# Altium project NanoEEG_v2_MCU.PrjPCB
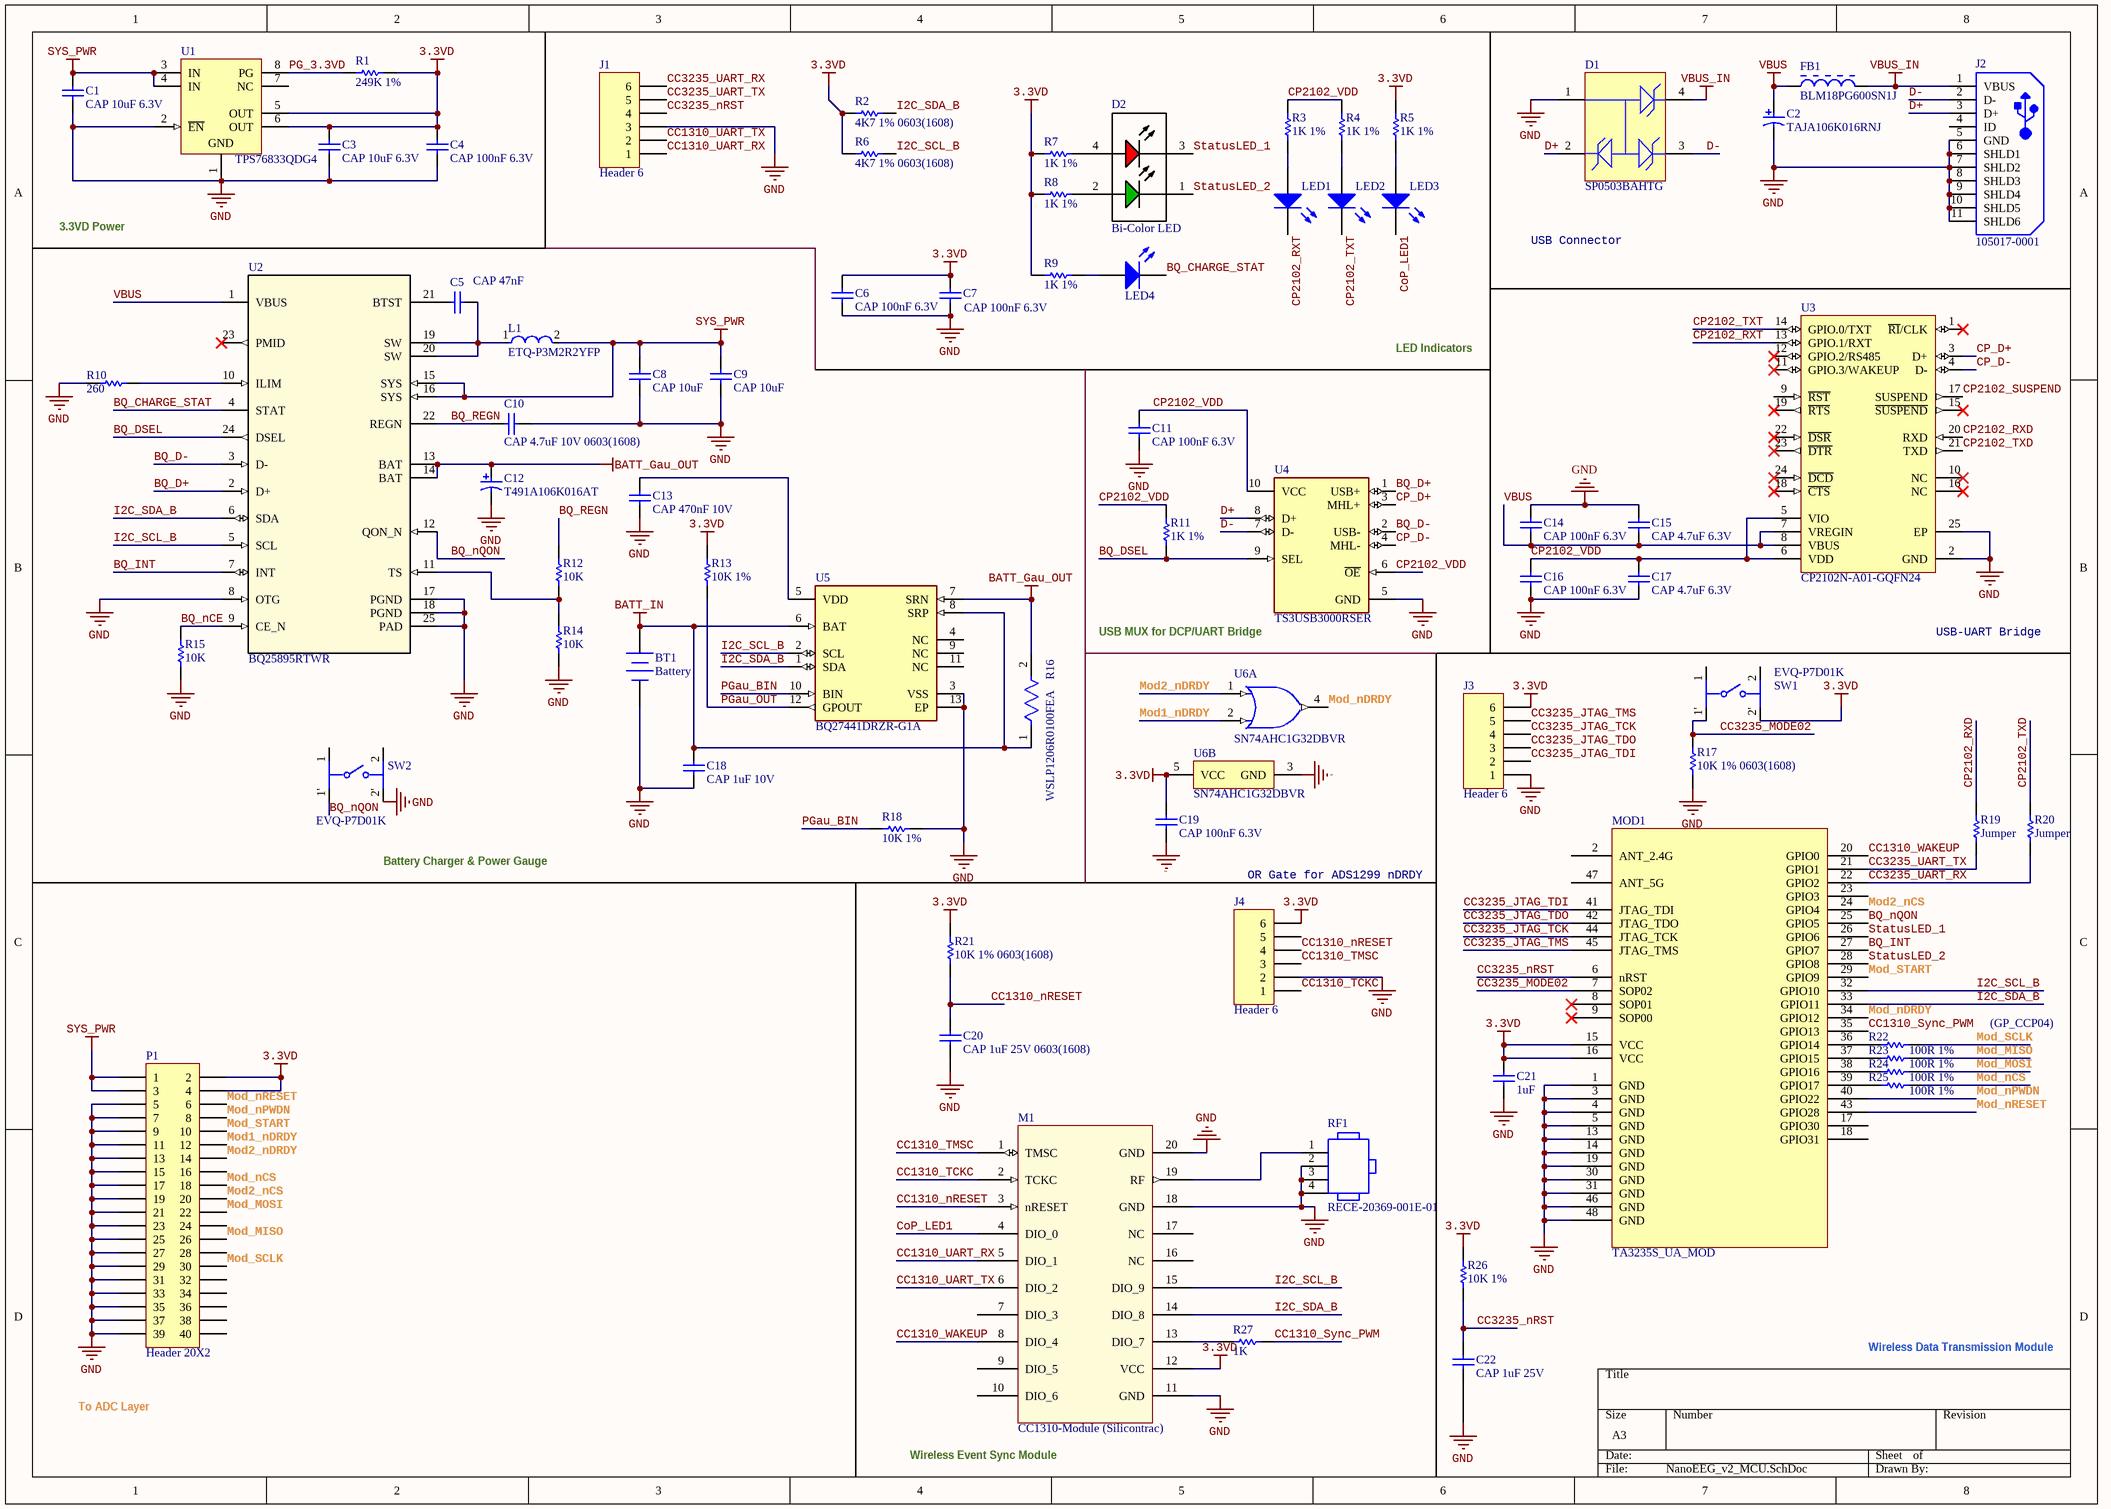
[diagram p0: NanoEEG_v2_MCU.SchDoc]
1 sheet, 75 parts. Net scope: global (net labels, ports and power ports of the same name join across sheets).
Board file: NanoEEG_v2_MCU.PcbDoc

## Sheet NanoEEG_v2_MCU.SchDoc
size A3

### Parts
(Parts that share a designator on the sheet are numbered #1, #2 ... from top to bottom, then left to right.)
BT1  Battery  [PH2.0-WS-2P]
C1  CAP 10uF 6.3V  [CAPC0603(1608)100_N]
C2  TAJA106K016RNJ  [CAPMP3217X18-T_V]
C3  CAP 10uF 6.3V  [CAPC0603(1608)100_N]
C4  CAP 100nF 6.3V  [CAPC0603(1608)100_N]
C5  CAP 47nF  [CAPC0603(1608)100_N]
C6  CAP 100nF 6.3V  [CAPC0603(1608)100_N]
C7  CAP 100nF 6.3V  [CAPC0603(1608)100_N]
C8  CAP 10uF  [CAPC0603(1608)100_N]
C9  CAP 10uF  [CAPC0603(1608)100_N]
C10  CAP 4.7uF 10V 0603(1608)  [CAPC0603(1608)55_N]
C11  CAP 100nF 6.3V  [CAPC0603(1608)100_N]
C12  T491A106K016AT  [KEMT-A-3216-18-2_N]
C13  CAP 470nF 10V  [CAPC0603(1608)100_N]
C14  CAP 100nF 6.3V  [CAPC0603(1608)100_N]
C15  CAP 4.7uF 6.3V  [CAPC0603(1608)100_N]
C16  CAP 100nF 6.3V  [CAPC0603(1608)100_N]
C17  CAP 4.7uF 6.3V  [CAPC0603(1608)100_N]
C18  CAP 1uF 10V  [CAPC0603(1608)100_N]
C19  CAP 100nF 6.3V  [CAPC0603(1608)100_N]
C20  CAP 1uF 25V 0603(1608)  [CAPC0603(1608)100_N]
C21  1uF  [CAPC0603(1608)100_N]
C22  CAP 1uF 25V  [CAPC0603(1608)100_N]
D1  SP0503BAHTG  [LFUS-SOT143-4_V]
D2  Bi-Color LED  [LED_Bi_Color_1204]
FB1  BLM18PG600SN1J  [MURA-BLM18PG_KG-CHIP-2_V2]
J1  Header 6  [GH-1.25-WS-6P]
J2  105017-0001  [USB-MICRO-B_V]
J3  Header 6  [GH-1.25-WS-6P]
J4  Header 6  [GH-1.25-WS-6P]
L1  ETQ-P3M2R2YFP  [FP-PCC-M0530M-MFG]
LED1  150060BS75000  [0603_A]  (value not drawn)
LED2  150060BS75000  [0603_A]  (value not drawn)
LED3  150060BS75000  [0603_A]  (value not drawn)
LED4  150060BS75000  [0603_A]  (value not drawn)
M1  CC1310-Module (Silicontrac)  [CC1310ZTR4-GC]
MOD1  TA3235S_UA_MOD  [TA_3235S_UA_MOD]
P1  Header 20X2  [FCI-B2B-0.8mm-40p-MALE]
R1  249K 1%  [RESC0603(1608)_N]
R2  4K7 1% 0603(1608)  [RESC0603(1608)_N]
R3  1K 1%  [RESC0603(1608)_N]
R4  1K 1%  [RESC0603(1608)_N]
R5  1K 1%  [RESC0603(1608)_N]
R6  4K7 1% 0603(1608)  [RESC0603(1608)_N]
R7  1K 1%  [RESC0603(1608)_N]
R8  1K 1%  [RESC0603(1608)_N]
R9  1K 1%  [RESC0603(1608)_N]
R10  260  [RESC0603(1608)_N]
R11  1K 1%  [RESC0603(1608)_N]
R12  10K  [RESC0603(1608)_N]
R13  10K 1%  [RESC0603(1608)_N]
R14  10K  [RESC0603(1608)_N]
R15  10K  [RESC0603(1608)_N]
R16  WSLP1206R0100FEA  [FP-WSLP1206-FP_1_65x1_93x-IPC_B]
R17  10K 1% 0603(1608)  [RESC0603(1608)_N]
R18  10K 1%  [RESC0603(1608)_N]
R19  Jumper  [RESC0603(1608)_N]
R20  Jumper  [RESC0603(1608)_N]
R21  10K 1% 0603(1608)  [RESC0603(1608)_N]
R22  100R 1%  [RESC0603(1608)_N]
R23  100R 1%  [RESC0603(1608)_N]
R24  100R 1%  [RESC0603(1608)_N]
R25  100R 1%  [RESC0603(1608)_N]
R26  10K 1%  [RESC0603(1608)_N]
R27  1K  [RESC0603(1608)_N]
RF1  RECE-20369-001E-01  [IPEX_MHF_I]
SW1  EVQ-P7D01K  [FP-EVQ-P7D01K-MFG]
SW2  EVQ-P7D01K  [FP-EVQ-P7D01K-MFG]
U1  TPS76833QDG4  [TI-D8_M]
U2  BQ25895RTWR  [RTW0024H]
U3  CP2102N-A01-GQFN24  [SLAB-QFN-24-2550x2550TP_A_V]
U4  TS3USB3000RSER  [FP-TS3USB3000RSER-MFG]
U5  BQ27441DRZR-G1A  [FP-DRZ0012A-MFG_M]
U6#1  SN74AHC1G32DBVR  [DBV0005A_N]  (part A of 2)
U6#2  SN74AHC1G32DBVR  [DBV0005A_N]  (part B of 2)

### Nets
3.3VD: C3.2 C4.2 C6.2 C7.2 C19.2 C21.2 J3.6 J4.6 M1.12(VCC) MOD1.15(VCC) MOD1.16(VCC) P1.2 P1.4 R1.2 R2.1 R5.2 R6.1 R7.1 R8.1 R9.2 R13.1 R21.2 R26.2 SW1.2' U1.5(OUT) U1.6(OUT) U6#2.5(VCC)
BATT_Gau_OUT: C12.1 R16.2 U2.13(BAT) U2.14(BAT) U5.7(SRN)
BATT_IN: BT1.1(+) C18.2 R16.1 U5.6(BAT) U5.8(SRP)
GND: BT1.2(-) C1.1 C2.2 C3.1 C4.1 C6.1 C7.1 C8.1 C9.1 C10.2 C11.1 C12.2 C13.1 C14.2 C15.2 C16.1 C17.1 C18.1 C19.1 C20.1 C21.1 C22.1 D1.1 J1.3 J2.5(GND) J2.6(SHLD1) J2.7(SHLD2) J2.8(SHLD3) J2.9(SHLD4) J2.10(SHLD5) J2.11(SHLD6) J3.1 J4.2 M1.11(GND) M1.18(GND) M1.20(GND) MOD1.1(GND) MOD1.3(GND) MOD1.4(GND) MOD1.5(GND) MOD1.13(GND) MOD1.14(GND) MOD1.19(GND) MOD1.30(GND) MOD1.31(GND) MOD1.46(GND) MOD1.48(GND) P1.5 P1.7 P1.9 P1.11 P1.13 P1.15 P1.17 P1.19 P1.21 P1.23 P1.25 P1.27 P1.29 P1.31 P1.33 P1.35 P1.37 P1.39 R10.1 R14.2 R15.2 R17.1 R18.2 RF1.2 RF1.3 RF1.4 SW2.2' U1.1(GND) U1.2(~{EN}) U2.8(OTG) U2.17(PGND) U2.18(PGND) U2.25(PAD) U3.2(GND) U3.25(EP) U4.5(GND) U5.3(VSS) U5.13(EP) U6#2.3(GND)
SYS_PWR: C1.2 C8.2 C9.2 L1.2 P1.1 P1.3 U1.3(IN) U1.4(IN) U2.15(SYS) U2.16(SYS)
VBUS: C2.1 C14.1 C15.1 FB1.1 U2.1(VBUS) U3.7(VREGIN) U3.8(VBUS)
VBUS_IN: D1.4 FB1.2 J2.1(VBUS)
BQ_CHARGE_STAT: LED4.1(K) U2.4(STAT)
BQ_D+: U2.2(D+) U4.1(USB+)
BQ_D-: U2.3(D-) U4.2(USB-)
BQ_DSEL: R11.2 U2.24(DSEL) U4.9(SEL)
BQ_INT: MOD1.27(GPIO7) U2.7(INT)
BQ_nCE: R15.1 U2.9(CE_N)
BQ_nQON: MOD1.25(GPIO5) SW2.1' U2.12(QON_N)
BQ_REGN: C10.1 R12.1 U2.22(REGN)
CC1310_nRESET: C20.2 J4.4 M1.3(nRESET) R21.1
CC1310_Sync_PWM: MOD1.35(GPIO13) R27.2
CC1310_TCKC: J4.1 M1.2(TCKC)
CC1310_TMSC: J4.3 M1.1(TMSC)
CC1310_UART_RX: J1.1 M1.5(DIO_1)
CC1310_UART_TX: J1.2 M1.6(DIO_2)
CC1310_WAKEUP: M1.8(DIO_4) MOD1.20(GPIO0)
CC3235_JTAG_TCK: J3.4 MOD1.44(JTAG_TCK)
CC3235_JTAG_TDI: J3.2 MOD1.41(JTAG_TDI)
CC3235_JTAG_TDO: J3.3 MOD1.42(JTAG_TDO)
CC3235_JTAG_TMS: J3.5 MOD1.45(JTAG_TMS)
CC3235_MODE02: MOD1.7(SOP02) R17.2 SW1.1'
CC3235_nRST: C22.2 J1.4 MOD1.6(nRST) R26.1
CC3235_UART_RX: J1.6 MOD1.22(GPIO2) R20.1
CC3235_UART_TX: J1.5 MOD1.21(GPIO1) R19.1
CoP_LED1: LED3.1(K) M1.4(DIO_0)
CP2102_RXD: R19.2 U3.20(RXD)
CP2102_RXT: LED1.1(K) U3.13(GPIO.1/RXT)
CP2102_SUSPEND: U3.17(SUSPEND)
CP2102_TXD: R20.2 U3.21(TXD)
CP2102_TXT: LED2.1(K) U3.14(GPIO.0/TXT)
CP2102_VDD: C11.2 C16.2 C17.2 R3.2 R4.2 R11.1 U3.5(VIO) U3.6(VDD) U4.6(~{OE}) U4.10(VCC)
CP_D+: U3.3(D+) U4.3(MHL+)
CP_D-: U3.4(D-) U4.4(MHL-)
D+: D1.2 J2.3(D+) U4.8(D+)
D-: D1.3 J2.2(D-) U4.7(D-)
I2C_SCL_B: M1.15(DIO_9) MOD1.32(GPIO10) R6.2 U2.5(SCL) U5.2(SCL)
I2C_SDA_B: M1.14(DIO_8) MOD1.33(GPIO11) R2.2 U2.6(SDA) U5.1(SDA)
Mod1_nDRDY: P1.12 U6#1.2(B)
Mod2_nCS: MOD1.24(GPIO4) P1.20
Mod2_nDRDY: P1.14 U6#1.1(A)
Mod_MISO: P1.26 R23.2
Mod_MOSI: P1.22 R24.2
Mod_nCS: P1.18 R25.2
Mod_nDRDY: MOD1.34(GPIO12) U6#1.4(Y)
Mod_nPWDN: MOD1.40(GPIO22) P1.8
Mod_nRESET: MOD1.43(GPIO28) P1.6
Mod_SCLK: P1.30 R22.2
Mod_START: MOD1.29(GPIO9) P1.10
PG_3.3VD: R1.1 U1.8(PG)
PGau_BIN: R18.1 U5.10(BIN)
PGau_OUT: R13.2 U5.12(GPOUT)
StatusLED_1: D2.3(Red-C) MOD1.26(GPIO6)
StatusLED_2: D2.1(Green-C) MOD1.28(GPIO8)
NetC5_1: C5.1 U2.21(BTST)
NetC5_2: C5.2 L1.1 U2.19(SW) U2.20(SW)
NetC13_2: C13.2 U5.5(VDD)
NetD2_2: D2.2(Green-A) R8.2
NetD2_4: D2.4(Red-A) R7.2
NetLED1_2: LED1.2(A) R3.1
NetLED2_2: LED2.2(A) R4.1
NetLED3_2: LED3.2(A) R5.1
NetLED4_2: LED4.2(A) R9.1
NetM1_13: M1.13(DIO_7) R27.1
NetM1_19: M1.19(RF) RF1.1
NetMOD1_36: MOD1.36(GPIO14) R22.1
NetMOD1_37: MOD1.37(GPIO15) R23.1
NetMOD1_38: MOD1.38(GPIO16) R24.1
NetMOD1_39: MOD1.39(GPIO17) R25.1
NetR10_2: R10.2 U2.10(ILIM)
NetR12_2: R12.2 R14.1 U2.11(TS)

Not connected (* = marked no-connect by the designer): J2 4(ID); J4 5; M1 7(DIO_3) 9(DIO_5) 10(DIO_6) 16(NC) 17(NC); MOD1 2(ANT_2.4G) 8(SOP01)* 9(SOP00)* 17(GPIO30) 18(GPIO31) 23(GPIO3) 47(ANT_5G); P1 16 24 28 32 34 36 38 40; SW1 1 2; SW2 1 2; U1 7(NC); U2 23(PMID)*; U3 1(~{RI}/CLK)* 9(~{RST}) 10(NC)* 11(GPIO.3/WAKEUP)* 12(GPIO.2/RS485)* 15(~{SUSPEND})* 16(NC)* 18(~{CTS})* 19(~{RTS})* 22(~{DSR})* 23(~{DTR})* 24(~{DCD})*; U5 4(NC) 9(NC) 11(NC)

### Notes on the sheet
- 3.3VD Power
- USB Connector
- LED Indicators
- (near U4) USB MUX for DCP/UART Bridge
- USB-UART Bridge
- Battery Charger & Power Gauge
- (near J4) OR Gate for ADS1299 nDRDY
- (GP_CCP04)
- Wireless Data Transmission Module
- To ADC Layer
- Wireless Event Sync Module

### Library data of the parts
BT1 = Battery: Multicell Battery; Published: 24-Mar-1999; LatestRevisionDate: 17-Jul-2002; LatestRevisionNote: Re-released for DXP Platform.; PackageReference: BAT-2; Publisher: Altium Limited; PackageDescription: Battery; 2 Leads
C1 C3 = CMP-1035-02796-1: CAP 10uF 6.3V ±10% 0603 (1608 Metric) Thickness 1mm SMD; Case-EIA: 0603; Tolerance: Â±10%; Case-Metric: 1608; Value: 10uF; Technology: SMT; Rated Voltage: 6.3 V; Max Thickness: 1 mm
C2 = CMP-1661-00004-1: Standard Tantalum, 10 uF, +/- 10%, 16 V, -55 to 125 degC, 2-Pin SMD (1206), RoHS, Tape and Reel; Frequency: 300 MHz; Vce Max: 500 mV; hFE Min: 60; Elements: 2; Case\Package: SOT-26; Max Power Dissipation: 300 mW; Min Operating Temperature: -55 degC; Width: 1.7 mm; ComponentLink2URL: http://datasheets.avx.com/TAJ.pdf; PackageDescription: 2-Pin Surface Mount Device, Body 3.2 x 1.65 mm; RoHSCompliant: true; ComponentLink2Description: Datasheet; Package Quantity: 3000; Max Operating Temperature: 150 degC; Length: 3.1 mm; Mount: Surface Mount; Packaging: Tape and Reel; ComponentLink1URL: http://www.avx.com/; ComponentLink1Description: Manufacturer URL; DatasheetVersion: Feb-16; ComponentLink3URL: http://www.avx.com/download/software/literature/AVX-Footprint-Library.pdf; ComponentLink3Description: Package Specification; Height: 1.3 mm; PackageReference: CAPMP3217X18-T; REACH SVHC: No SVHC; Pins: 6; Radiation Hardening: No
C4 C6 C7 C19 = CMP-1035-02576-1: CAP 100nF 6.3V ±10% 0603 (1608 Metric) Thickness 1mm SMD; Tolerance: Â±10%; Case-Metric: 1608; Case-EIA: 0603; Max Thickness: 1 mm; Value: 100nF; Rated Voltage: 6.3 V; Technology: SMT
C5 = CMP-1035-02503-1: CAP 47nF 16V ±10% 0603 (1608 Metric) Thickness 1mm SMD; Tolerance: Â±10%; Case-EIA: 0603; Case-Metric: 1608; Technology: SMT; Rated Voltage: 16 V; Max Thickness: 1 mm; Value: 47nF
C8 C9 = CMP-1035-02799-1: CAP 10uF 10V ±10% 0603 (1608 Metric) Thickness 1mm SMD; Tolerance: Â±10%; Case-Metric: 1608; Case-EIA: 0603; Max Thickness: 1 mm; Technology: SMT; Rated Voltage: 10 V; Value: 10uF
C10 = CMP-1035-02786-1: CAP 4.7uF 10V ±20% 0603 (1608 Metric) Thickness 0.55mm SMD; Tolerance: Â±20%; Case-EIA: 0603; Case-Metric: 1608; Technology: SMT; Max Thickness: 0.55 mm; Rated Voltage: 10 V; Value: 4.7uF
C11 C14 C16 = CMP-1035-02575-1: CAP 100nF 6.3V ±5% 0603 (1608 Metric) Thickness 1mm SMD; Tolerance: Â±5%; Case-Metric: 1608; Case-EIA: 0603; Technology: SMT; Rated Voltage: 6.3 V; Max Thickness: 1 mm; Value: 100nF
C12 = CMP-2000-05173-1: Capacitor, Tantalum, 10 uF, +/- 10%, 16 V, -55 to 125 degC, 2-Pin SMD (1206), RoHS, Tape and Reel; Manufacturer: Kemet; Insulation: NotRequired; Voltage: 16VDC; Capacitance: 10uF; Product Height (mm): 1.6mm; Polarity: Polar; Lead Spacing (nom): NotRequiredmm; Product Length (mm): 3.2mm; Case Style: Molded; DCL: 1.6uA; ESR: 7ohm; DF: 8%; Mounting Style: SurfaceMount; Manufacturer URL: http://www.kemet.com/; Datasheet Version: Apr-14; Package Description: 2-Pin Surface Mount Device, Body 3.2 x 1.6 mm; Operating Temp Range: -55Cto125C; Package Reference: 1206; Wire Form: NotRequired; Datasheet URL: http://www.farnell.com/datasheets/1824869.pdf; Tolerance (+ or -): 10%; Failure Rate: NotRequired; Length W/Weld: NotRequiredmm; Package / Case: 3216-18; Seated Plane Height: NotRequiredmm; Product Diameter (mm): NotRequiredmm; Construction: SMTChip; Seal: NotRequired; Case Code: A; Product Depth (mm): 1.6mm; Packaging: TapeandReel
C13 = CMP-1035-02697-1: CAP 470nF 10V ±20% 0603 (1608 Metric) Thickness 1mm SMD; Case-EIA: 0603; Case-Metric: 1608; Tolerance: Â±20%; Max Thickness: 1 mm; Rated Voltage: 10 V; Technology: SMT; Value: 470nF
C15 C17 = CMP-1035-02782-1: CAP 4.7uF 6.3V ±20% 0603 (1608 Metric) Thickness 1mm SMD; Case-EIA: 0603; Tolerance: Â±20%; Case-Metric: 1608; Technology: SMT; Rated Voltage: 6.3 V; Max Thickness: 1 mm; Value: 4.7uF
C18 = CMP-1035-02733-1: CAP 1uF 10V ±10% 0603 (1608 Metric) Thickness 1mm SMD; Tolerance: Â±10%; Case-EIA: 0603; Case-Metric: 1608; Rated Voltage: 10 V; Max Thickness: 1 mm; Value: 1uF; Technology: SMT
C20 C22 = CMP-1035-02741-1: CAP 1uF 25V ±20% 0603 (1608 Metric) Thickness 1mm SMD; Tolerance: Â±20%; Case-EIA: 0603; Case-Metric: 1608; Max Thickness: 1 mm; Technology: SMT; Rated Voltage: 25 V; Value: 1uF
C21 = CMP-1035-02588-1: CAP 100nF 25V ±10% 0603 (1608 Metric) Thickness 1mm SMD; Case-Metric: 1608; Case-EIA: 0603; Tolerance: Â±10%; Max Thickness: 1 mm; Technology: SMT; Rated Voltage: 25 V; Value: 100nF
D1 = CMP-2000-05191-1: TVS Diode Array, 30 pF, 30 KV, -40 to 85 degC, 4-Pin SOT143, RoHS, Tape and Reel; Manufacturer: Littelfuse; Direction Type: Uni-Directional; Product Height (mm): 1.05mm; Leakage Current (Max): 0.1uA; Clamping Voltage (Max): 8V; Reverse Stand-off Voltage: 5.5(Min)V; Configuration: Triple; Working Voltage: 5.5V; Product Length (mm): 3.04mm; Working Voltage (Max): 5.5V(Min); Capacitance Value: 30pF; Rad Hardened: No; Number of Elements: 3; Product Depth (mm): 1.4mm; Operating Temperature Max Deg. C: 85C; Suppressor Type: TVS; Operating Temperature Min Deg. C: -40C; Operating Temp Range: -40Cto85C; Mounting: SurfaceMount; Package / Case: SOT-143; Datasheet Version: Dec-13; Package Type: SOT-143; Packaging: TapeandReel; Pin Count: 3+Tab; Operating Temperature Classification: Industrial; Datasheet URL: https://datasheet.ciiva.com/15143/getdatasheetpartid-116020-15143550.pdf; Manufacturer URL: http://www.littelfuse.com/; Leakage Current: 0.1uA; Mounting Style: SurfaceMount; Clamping Voltage: 8V; Polarity: Uni-Directional
D2 = LED-RG-KAAK-4: LED Indicator, Red / Green, 2 V, -40 to 100 degC, 4-Pin SMD, RoHS, Tape and Reel; Manufacturer: Dialight; Forward Voltage: 2.6V; Rad Hardened: No; Reverse Voltage: 5V; Product Length (mm): 4.3mm; Dominant Wave Length: 570/628nm; Forward Current: 30mA; Lens Type: NonDiffused; Shape Type: Circular; Product Depth (mm): 8.8mm; Number of  Elements: 2; Power Dissipation: 100W; Luminous Intensity: 8/6.5mcd; Main Category: ChipLED; DELETED: Compliant; Test Current (It): 20mA; Emitting Color: YellowGreen/Red; Viewing Angle: 40deg; Product Height (mm): 5mm; Pin Count: 2; Operating Temp Range: -55Cto100C; Package Type: SMD; Type: Bi-Color; High Brightness: No; Packaging: TapeandReel; Package Description: 4-Pin Surface Mount Device, Body 4.32 x 8.77 mm, Pitch 1.5 mm; Operating Temperature Classification: Industrial; Lens Dimensions: 2.8x2.8x2.7mm; Mounting Technology: SurfaceMount; Datasheet Version: Rev. B, 10/2010; Lum Intensity: 8/6.5mcd; Package Reference: 591-3001-013F; Mounting: SurfaceMount; Manufacturer URL: http://www.dialight.com/; Datasheet URL: https://datasheet.ciiva.com/2132/c17245-2132277.pdf
FB1 = CMP-0686-00574-2: Chip Ferrite Bead for Power Lines, 60 Ohm, 500 mA, -55 to 125 degC, 1.6 x 0.8 x 0.95 mm SMD, Tape and Reel; Manufacturer: Murata; Impedance (at 100 MHz): 60 Ohm Typ.; Rated Current: 500 mA; DC Resistance: 0.10 Ohm Max.; ComponentLink2URL: http://www.murata.com/products/catalog/pdf/c31e.pdf; ComponentLink1Description: Manufacturer URL; Operating Temperature Range: -55 to 125 degC; DatasheetVersion: 08/2013; PackageDescription: 2-Pin Chip, Body 1.6 x 0.8 mm; PackageReference: BLM18_H950-2; ComponentLink2Description: Datasheet; PartNumber: BLM18PG600SN1J; Mounting Technology: Surface Mount; ComponentLink3URL: http://www.murata.com/products/catalog/pdf/c31e.pdf; ComponentLink3Description: Package Specification; Packing: Tape and Reel; ComponentLink1URL: http://www.murata.com/
J1 J3 J4 = Header 6: Header, 6-Pin; LatestRevisionDate: 17-Jul-2002; LatestRevisionNote: Re-released for DXP Platform.; Publisher: Altium Limited
J2 = CMP-2000-05827-1: Micro-USB B Receptacle, Right Angle, Bottom Mount, Surface Mount, with Solder Tabs, -30 to 85 degC, 5-Pin USB, RoHS, Tape and Reel; Manufacturer: Molex; Featured Product: Micro-USBConnectorsUSBConnectors; Other Names: WM1399DKR; Package Version: Rev. F, 12/2012; Number of Contacts: 5; Connector Type: USB-microB; Catalog Drawings: 1050170001; 3D Model: 105017-0001.stp; Mating Products: WM17145-ND-CABLEMICROUSBBTOSTDA1.0MWM17147-ND-CABLEMICROUSBBTOSTDA2.0MWM17146-ND-CABLEMICROUSBBTOSTDA1.5M; PCN Assembly/Origin: ResinSupplier21/Oct/2015; Voltage - Max: 30V; Online Catalog: Molex-MicroUSB; Manufacturer URL: http://www.molex.com/; Package Description: 5-Leads USB, Micro B, Body 7.5 x 5 mm, Pitch 0.65 mm; Datasheet URL: http://www.molex.com/elqNow/elqRedir.htm?ref=http://www.molex.com/webdocs/datasheets/pdf/en-us/1050170001_IO_CONNECTORS.pdf; Ingress Protection: -; Datasheet Version: 03/2016; Mounting Type: BoardCutout,SurfaceMount,RightAngle; Circuits: 5; Standard Package: 1; Package Reference: MICRO-B; Package URL: http://www.molex.com/pdm_docs/sd/1050170001_sd.pdf; Category: Connectors,Interconnects; Series: -; RoHS Information: 1050170001CertofCompliance; Features: Shielded,SolderRetention; Family: USB,DVI,HDMIConnectors; Specifications: -; Gender: Receptacle; Packaging: Digi-Reel®; Mounting Technology: SurfaceMount
L1 = CMP-05439-000009-1: FIXED IND 2.2UH 5.8A 24.8 MOHM; Manufacturer: Panasonic; Tolerance: 20%; Automotive Grade: Grade 0; Standoff Height: 0.05mm; Series Resistance: 24.8mΩ; Core Material: Metal Composite; Test Frequency: 100kHz; Saturation Current: 10.9A; Rms Current: 4.8A; Shielding: true; Temperature Range Low: -40°C; Category: Ind; Temperature: -40°C to +150°C; Lead Free: Yes; Temperature Range High: +150°C; Height: 3mm; Manufacturer Part Number: ETQ-P3M2R2YFP; Value: 2.2uH; Device Class L3: Fixed Inductors; Automotive: Yes; Inductance: 2.2uH; Device Class L2: Inductors; ComponentLink2URL: https://industrial.panasonic.com/cdbs/www-data/pdf/AGL0000/AGL0000C59.pdf; ComponentLink2Description: Datasheet; Octopart: https://octopart.com/etqp3m2r2yfp-panasonic-65686337; Device Class L1: Passive Components; Digikey Description: FIXED IND 2.2UH 5.8A 24.8 MOHM; RoHS: TRUE; Package: PCC-M0530M
LED1-LED4 = CMP-1426-00003-1: SMD mono-color Chip LED, WL-SMCW, Blue; Manufacturer: Wuerth Elektronik; Color: Blue; ComponentLink2Description: Datasheet; ComponentLink2URL: http://katalog.we-online.com/led/datasheet/150060BS75000.pdf; ComponentLink1URL: http://www.we-online.com; PackageReference: 0603_A; PartNumber: 150060BS75000; ComponentLink1Description: Manufacturer URL
M1 = CC1310-MOD
MOD1 = TA3235S_MOD: TA3235S Dual Band Wifi MOD
P1 = Header 20X2: Header, 20-Pin, Dual row; LatestRevisionDate: 17-Jul-2002; LatestRevisionNote: Re-released for DXP Platform.; Publisher: Altium Limited
R1 = CMP-1012-00779-1: 249K 0.1W 1% 0603 (1608 Metric)  SMD; Case-Metric: 1608; Case-EIA: 0603; Value: 249000.00 Ohm; Technology: SMT; Power: 0.1 W; Tolerance: 1 %
R2 R6 = CMP-1012-00586-1: 4K7 0.1W 1% 0603 (1608 Metric)  SMD; Case-EIA: 0603; Case-Metric: 1608; Value: 4700.00 Ohm; Power: 0.1 W; Tolerance: 1 %; Technology: SMT
R3-R5 R7-R9 R11 = CMP-1012-00510-1: 1K 0.1W 1% 0603 (1608 Metric)  SMD; Case-Metric: 1608; Case-EIA: 0603; Value: 1000.00 Ohm; Technology: SMT; Tolerance: 1 %; Power: 0.1 W
R10 R12 R14 R15 R27 = CMP-1012-00625-1: 10K5 0.1W 1% 0603 (1608 Metric)  SMD; Case-EIA: 0603; Case-Metric: 1608; Value: 10500.00 Ohm; Power: 0.1 W; Technology: SMT; Tolerance: 1 %
R13 R17 R18 R21 R26 = CMP-1012-00623-1: 10K 0.1W 1% 0603 (1608 Metric)  SMD; Value: 10000.00 Ohm; Case-EIA: 0603; Case-Metric: 1608; Power: 0.1 W; Tolerance: 1 %; Technology: SMT
R16 = CMP-2003-04373-2: RES 0.01 OHM 1% 1W 1206; Temperature Coefficient: 75ppm/°C; Resistance: 10mR; Features: Moisture Resistant; Case/Package: 1206; Military Standard: Not; Case Code (Imperial): 1206; Power Rating: 1W; Number of Terminations: 2; Lead Free: Lead Free; Number of Pins: 2; Min Operating Temperature: -65°C; Weight: 0.000571oz; Radiation Hardening: No; Series: WSLP; Length: 3.2mm; Termination: SMD/SMT; Mount: Surface Mount; Size Code: 1206; Height: 0.035inch; Case Code (Metric): 3216; Resistance Tolerance: 1%; Contact Plating: Tin; Width: 0.063inch; Construction: Rectangular; Packaging: Tape and Reel; Package Quantity: 1; RoHS Compliant: Yes; Depth: 1.6mm; Tolerance: 1%; Max Operating Temperature: 170°C; Max Power Dissipation: 1W; Resistor Type: Metal Strip
R19 R20 = CMP-1012-00001-1: Jumper 0603 (1608 Metric); Case-Metric: 1608; Value: 0.00 Ohm; Power: None; Case-EIA: 0603; Technology: SMT; Tolerance: None
R22-R25 = CMP-1012-00397-1: 100R 0.1W 1% 0603 (1608 Metric)  SMD; Value: 100.00 Ohm; Case-EIA: 0603; Case-Metric: 1608; Technology: SMT; Tolerance: 1 %; Power: 0.1 W
RF1 = TG-RECE-20369-001E-01-4: RF Connector, Onboard Receptacle, IPEX MHFIII; Manufacturer: Taoglas; Packing: Tape and Reel; Mounting Technology: Surface Mount; PackageReference: RECE-20369-001E-01-4; Housing Color: Gold; ComponentLink2URL: http://www.taoglas.com/images/product_images/original_images/RECE.20369.001E.01.pdf; ComponentLink3Description: Package Specification; PackageDescription: 4-Pin, Hand Drawn, Body 1.7x1.7mm; DatasheetVersion: Rev. C; ComponentLink1Description: Manufacturer URL; ComponentLink2Description: Datasheet; ComponentLink1URL: http://www.taoglas.com/; PartNumber: RECE-20369-001E-01; ComponentLink3URL: http://www.taoglas.com/images/product_images/original_images/RECE.20369.001E.01.pdf; PackageVersion: Rev. C
SW1 SW2 = CMP-05618-000102-1: SWITCH TACTILE SPST-NO 0.05A 12V; Max Current Rating: 50mA; Throw Configuration: SPST; Switch Function: Off-Mom; Contact Resistance: 500mR; Operating Force: 2.2N; Illumination Type: Non-Illuminated; Electrical Life: 100000Cycles; Actuator Color: Black; Actuator Length: 0.65mm; Switch Travel: 0.2mm; Min Operating Temperature: -20°C; Packaging: Tape and Reel; Orientation: Right Angle; Contact Current Rating: 50mA; Radiation Hardening: No; Length: 4.3mm; Current Rating: 50mA; Max Operating Temperature: 70°C; Mount: Surface Mount; Voltage Rating (DC): 12V; Max Voltage Rating (DC): 12V; Size: 2.9mm; Termination: J-Bend; Depth: 3.55mm; Series: EVQP7; Mechanical Life: 100000Cycles; Lead Free: Lead Free; REACH SVHC: No SVHC; Package Quantity: 1
U1 = CMP-0395-00117-1: Single Output Fast Transient Response LDO, 1 A, Fixed 3.3 V Output, 2.7 to 10 V Input, with Low IQ, 8-pin SOIC (D), -40 to 125 degC, Green (RoHS & no Sb/Br); Manufacturer: Texas Instruments; Vin(Min)(V): 2.7; Fixed Output Options(V): 3.3; Iq(Typ)(mA): 0.08; Vdo(Typ)(mV): 350; Power Good: TRUE; Iout(Max)(A): 1; Accuracy(%): 2; SubFamily: Single Channel LDO; Vin(Max)(V): 10; PackageVersion: 4040047-3/M; PackageReference: D8; PartNumber: TPS76833QDG4; Code_JEDEC: MS-012; DatasheetVersion: SLVS211L; Vout Adj(Min)(V): 3.3; ComponentLink2Description: Datasheet; PackageDescription: 8-Pin Plastic Small Outline, Body 4.9 x 3.9 mm, Pitch 1.27 mm; ComponentLink3URL: http://www.ti.com/litv/pdf/msoi002j; Vout Adj(Max)(V): 3.3; ComponentLink1Description: Manufacturer URL; Mounting Technology: Surface Mount; ComponentLink3Description: Package Specification; ComponentLink2URL: http://www.ti.com/general/docs/lit/getliterature.tsp?genericPartNumber=TPS76833&fileType=pdf; ComponentLink1URL: http://www.ti.com/; Eco-Plan: Green (RoHS & no Sb/Br)
U2 = BQ25895RTWR: Imported; Alternate_PartNumber: BQ25895RTWT; Manufacturer: Texas Instruments; CompType: IC; PIN_COUNT: 25; Application_BuildNumber: *; PartNumber: BQ25895RTWR; PackageReference: RTW0024H; MountType: SMT; RefDes: RefDes; TYPE: TYPE; Value: Value
U3 = SLAB-CP2102N-QFN-24: USBXpress(TM) Family, 4 GPIOs, 2.2 to 3.6 V, -40 to 85 degC, 24-Pin QFN, RoHS; Manufacturer: Silicon Labs; Max Supply Voltage: 3.6V; Min Supply Voltage: 3V; Datasheet Version: Rev. 1.1, 08/2016; Max Operating Temperature: 85degC; Case\/Package: QFN; Number of Pins: 24; Min Operating Temperature: -40degC; Mounting Technology: SurfaceMount; Manufacturer URL: http://www.silabs.com/; RoHSCompliant: False; Package Reference: QFN-24-2550x2550TP_A; Datasheet URL: http://www.silabs.com/documents/public/data-sheets/cp2102n-datasheet.pdf; Package Description: 24-Pin Quad Flat No-lead Package, Body 4 x 4 mm, Pitch 0.5 mm; REACH SVHC: Unknown
U4 = CMP-04892-000009-1: IC USB SW/MHL DPDT 10UQFN; Manufacturer: Texas Instruments; On State Resistance: 5.7Ω; Min Supply Voltage: 2.3V; Number Of Circuits: 2; -3Db Bandwith: 6.1GHz; Standoff Height: 0mm; Max Supply Voltage: 4.8V; Nominal Supply Current: 30uA; Temperature Range High: +85°C; Ambient Temperature Range High: +85°C; Package: UQFN10; Category: IC; Temperature: -40°C to +85°C; Device Class L2: Interface ICs; Height: 0.6mm; Lead Free: Yes; RoHS: TRUE; Ipc Land Pattern Name: QFN50P150X200X55-10; Digikey Description: IC USB SW/MHL DPDT 10UQFN; Octopart: https://octopart.com/ts3usb3000rser-texas+instruments-25746917; Automotive: No; Device Class L1: Integrated Circuits (ICs); Ambient Temperature Range Low: -40°C; Mouser Description: DPDT USB 2.0 High-Speed and Mobile High-Definition Link (MHL) (6.1GHz) Switch 10-UQFN -40 to 85; Temperature Range Low: -40°C; Device Class L3: Analog Switches; ComponentLink2URL: http://www.ti.com/lit/ds/symlink/ts3usb3000.pdf; Manufacturer Part Number: TS3USB3000RSER; ComponentLink2Description: Datasheet; Throw Configuration: DPDT; Interface: USB
U5 = 0f562f18464a1f07b55dcd927f1fdf2: IC BATT FUEL GAUGE LI-ION 12SON; Manufacturer: Texas Instruments; Number Of Cells: 1; Nominal Supply Current: 93uA; Max Supply Voltage: 4.5V; Standoff Height: 0mm; Min Supply Voltage: 2.45V; Output Voltage: 1.8V; Temperature Range High: +85°C; Temperature: -40°C to +85°C; Device Class L2: Power Management ICs; Device Class L1: Integrated Circuits (ICs); Lead Free: Yes; Height: 1mm; Package: DRZ0012A; Number Of Outputs: 1; ComponentLink2URL: http://www.ti.com/lit/gpn/bq27441-g1; Ambient Temperature Range High: +85°C; Category: IC; Manufacturer Part Number: BQ27441DRZR-G1A; Device Class L3: Battery Management; RoHS: TRUE; Octopart: https://octopart.com/bq27441drzr-g1a-texas+instruments-30555829; Ambient Temperature Range Low: -40°C; Automotive: No; Mouser Description: System-Side Impedance Track? Battery Fuel (Gas) Gauge 12-SON -40 to 85; Digikey Description: IC BATT FUEL GAUGE LI-ION 12SON; Temperature Range Low: -40°C; ComponentLink2Description: Datasheet
U6#1 U6#2 = CMP-0859-00115-3: Single 2-Input Positive-OR Gate, DBV0005A, LARGE T&R; Manufacturer: Texas Instruments; Rating: Catalog; Sub-Family: OR Gate; 3-State Output: No; Logic: True; VCC(Min)(V): 2; Voltage(Nom)(V): 3.3,5; F @ Nom Voltage(Max)(Mhz): 75; VCC(Max)(V): 5.5; Output Type: CMOS; Output Drive (IOL/IOH)(Max)(mA): 50/-50; tpd @ Nom Voltage(Max)(ns): 13,8.5; Technology Family: AHC; Gate Type: OR; Bits(#): 1; ICC @ Nom Voltage(Max)(mA): 0.01; DatasheetVersion: SCLS317O; Generic Part Number: SN74AHC1G32; Input Type: CMOS; PackageReference: DBV0005A; Schmitt Trigger: No; Operating Temperature Range(C): -40 to 125